# Altium project RpiNeoCore_Display.PrjPcb (part 3 of 3)
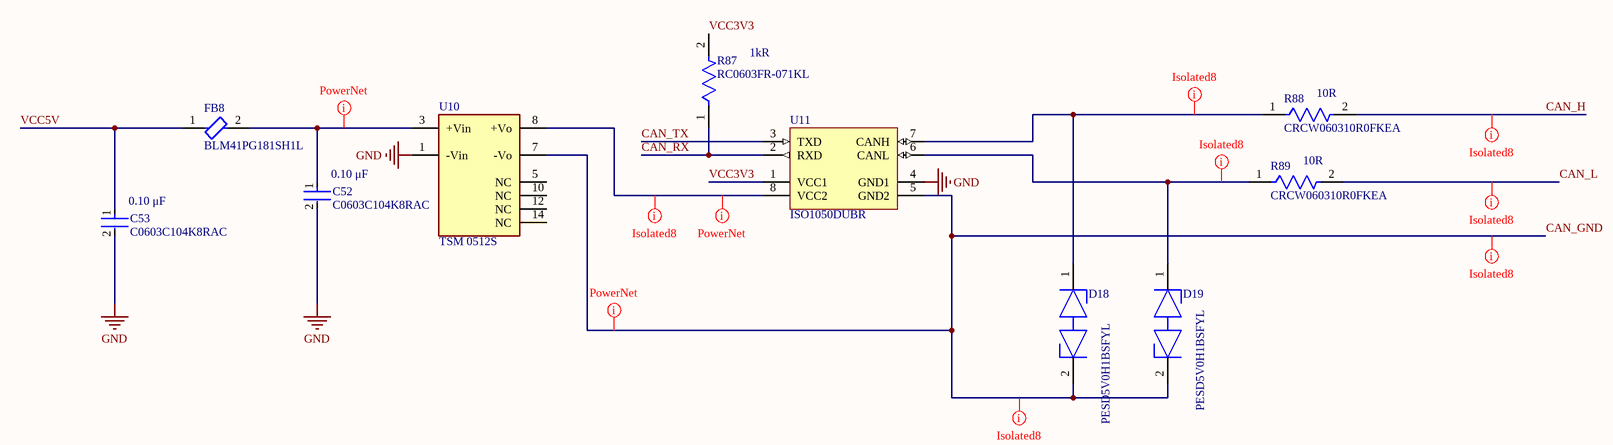
[diagram p11: CANBUS.SchDoc]

## Nets that join several sheets
GND: Ethernet (10 pins), Sheet1 (35 pins), Power (18 pins), DigitalInputs (8 pins), LED_DRIVER (7 pins), AlarmRelay (5 pins), AnalogInputs (8 pins), SerialCommunication (6 pins), SerialCommunication1 (6 pins), SerialCommunication2 (6 pins), CANBUS (C52.2 C53.2 U10.1 U11.4)
A_IN1: Sheet1 (J3.4), AnalogInputs (R46.1 R51.1)
A_IN2: Sheet1 (J3.5), AnalogInputs (R53.1 R58.1)
AGND: Sheet1 (J3.6), AnalogInputs (10 pins)
ALARM_COM: Sheet1 (J2.5), AlarmRelay (K1.2)
ALARM_NC: Sheet1 (J2.4), AlarmRelay (K1.4)
ALARM_NO: Sheet1 (J2.6), AlarmRelay (K1.3)
ALARM_ON: Sheet1 (J6.22), AlarmRelay (R44.1)
ANALOG_CH1: Sheet1 (J6.21), AnalogInputs (C37.2 R50.2 U6.1)
ANALOG_CH2: Sheet1 (J6.23), AnalogInputs (C39.2 R56.2 U6.7)
CAN_GND: Sheet1 (J3.3), CANBUS (D18.2 D19.2 U10.7 U11.5)
CAN_H: Sheet1 (J3.1), CANBUS (R88.2)
CAN_L: Sheet1 (J3.2), CANBUS (R89.2)
CAN_RX: Sheet1 (J6.11), CANBUS (R87.1 U11.2)
CAN_TX: Sheet1 (J6.09), CANBUS (U11.3)
DI1+: Sheet1 (J2.1), DigitalInputs (D5.2 R19.1)
DI1-: Sheet1 (J2.3), DigitalInputs (D5.1 D8.1 R23.1 R29.1)
DI2+: Sheet1 (J2.2), DigitalInputs (D8.2 R25.1)
Display_LED_MINUS: Sheet1 (J8.31 J8.32), LED_DRIVER (B2.3 R39.2 R40.2)
Display_LED_PLUS: Sheet1 (J8.39 J8.40), LED_DRIVER (B2.5 C27.1 C28.1 D9.2)
ETH1_N: Ethernet (J5.2 T1.22), Sheet1 (J2.10)
ETH1_P: Ethernet (J5.1 T1.23), Sheet1 (J2.9)
ETH2_N: Ethernet (J5.6 T1.19), Sheet1 (J2.12)
ETH2_P: Ethernet (J5.3 T1.20), Sheet1 (J2.11)
LED_PWM: Sheet1 (J1.36), LED_DRIVER (R38.2)
Link_LED: Ethernet (R7.2), Sheet1 (J7.55)
MDI0_N: Ethernet (T1.3), Sheet1 (J7.51)
MDI0_P: Ethernet (T1.2), Sheet1 (J7.53)
MDI1_N: Ethernet (T1.6), Sheet1 (J7.47)
MDI1_P: Ethernet (T1.5), Sheet1 (J7.49)
MDI2_N: Ethernet (T1.9), Sheet1 (J7.68)
MDI2_P: Ethernet (T1.8), Sheet1 (J7.66)
MDI3_N: Ethernet (T1.12), Sheet1 (J7.67)
MDI3_P: Ethernet (T1.11), Sheet1 (J7.65)
SERIAL1_DEN: Sheet1 (J1.26), SerialCommunication (R61.1 U7.5)
SERIAL1_REN: Sheet1 (J1.27), SerialCommunication (R62.1 U7.4)
SERIAL1_RX: Sheet1 (J7.3), SerialCommunication (U7.3)
SERIAL1_TX: Sheet1 (J7.4), SerialCommunication (U7.6)
SERIAL1_TX_RX_A: Sheet1 (J3.12), SerialCommunication (D12.1 L3.1)
SERIAL1_TX_RX_B: Sheet1 (J3.11), SerialCommunication (D13.2 L4.1)
SERIAL2_DEN: Sheet1 (J1.23), SerialCommunication1 (R70.1 U8.5)
SERIAL2_REN: Sheet1 (J1.25), SerialCommunication1 (R71.1 U8.4)
SERIAL2_RX: Sheet1 (J7.5), SerialCommunication1 (U8.3)
SERIAL2_TX: Sheet1 (J7.6), SerialCommunication1 (U8.6)
SERIAL2_TX_RX_A: Sheet1 (J3.10), SerialCommunication1 (D14.1 L5.1)
SERIAL2_TX_RX_B: Sheet1 (J3.9), SerialCommunication1 (D15.2 L6.1)
SERIAL3_DEN: Sheet1 (J1.21), SerialCommunication2 (R79.1 U9.5)
SERIAL3_REN: Sheet1 (J1.24), SerialCommunication2 (R80.1 U9.4)
SERIAL3_RX: Sheet1 (J7.7), SerialCommunication2 (U9.3)
SERIAL3_TX: Sheet1 (J7.8), SerialCommunication2 (U9.6)
SERIAL3_TX_RX_A: Sheet1 (J3.8), SerialCommunication2 (D16.1 L7.1)
SERIAL3_TX_RX_B: Sheet1 (J3.7), SerialCommunication2 (D17.2 L8.1)
Speed_LED: Ethernet (R8.2), Sheet1 (J7.57)
VCC3V3: Sheet1 (7 pins), Power (C20.1 U1.5), DigitalInputs (R18.2 R20.2 R24.2 R26.2), SerialCommunication (R63.1), SerialCommunication1 (R72.1), SerialCommunication2 (R81.1), CANBUS (R87.2 U11.1)
VCC5V: Sheet1 (6 pins), Power (7 pins), LED_DRIVER (5 pins), AlarmRelay (C31.2 D10.3 K1.1 R43.2), AnalogInputs (6 pins), SerialCommunication (R60.1), SerialCommunication1 (R69.1), SerialCommunication2 (R78.1), CANBUS (C53.1 FB8.1)
VCC24V: Sheet1 (J2.8), Power (FB1.1)